# Altium project PCB.PrjPcb
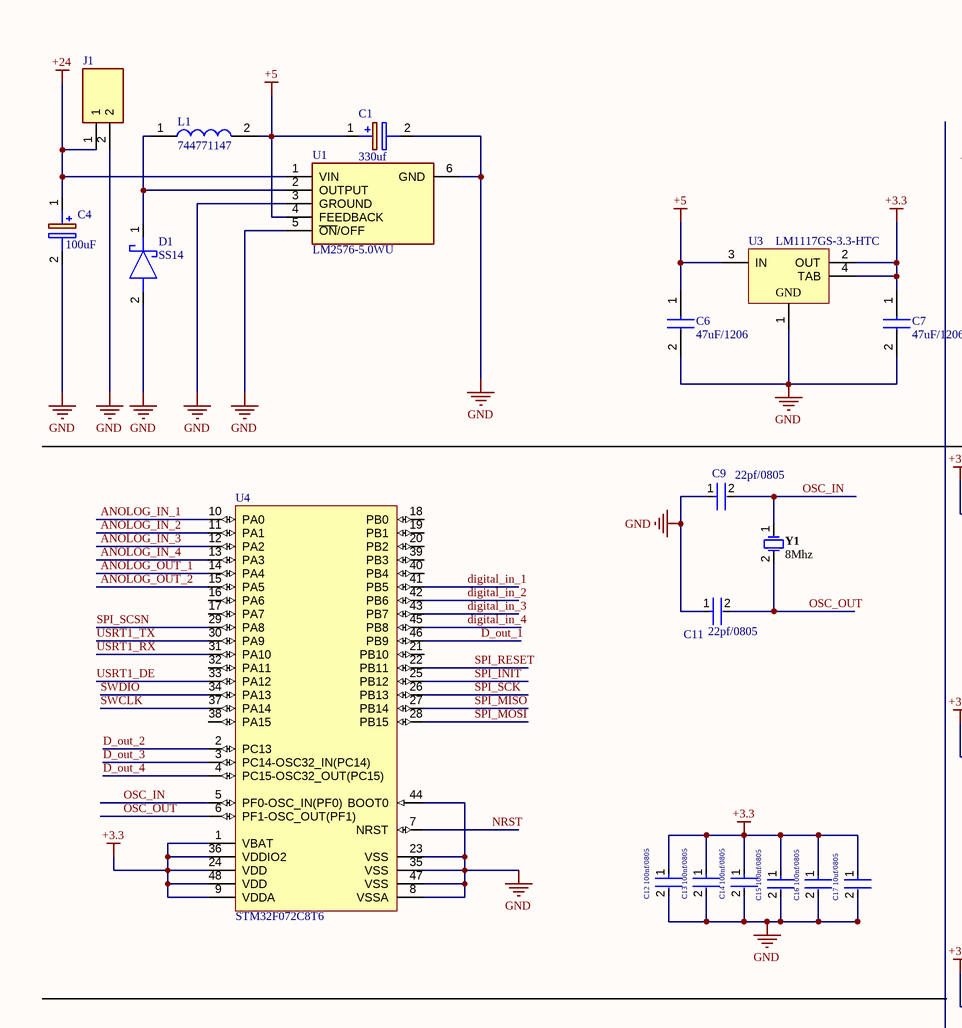
[diagram p0: Sheet1.SchDoc, top left]
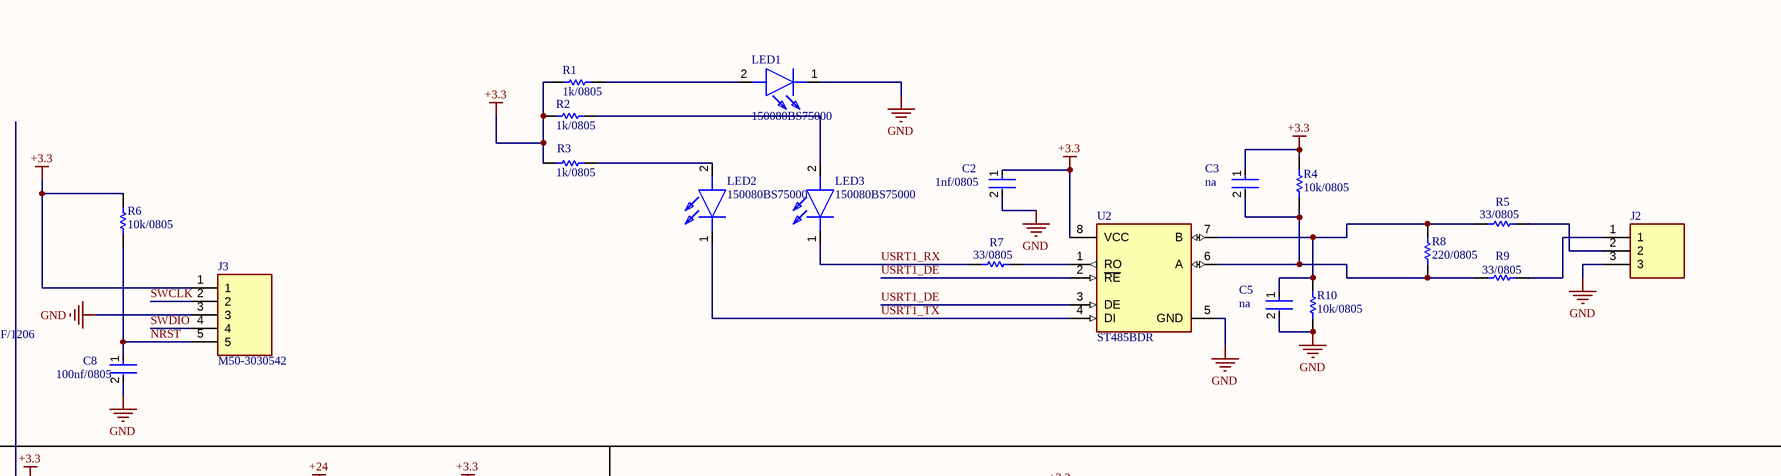
[diagram p1: Sheet1.SchDoc, top right]
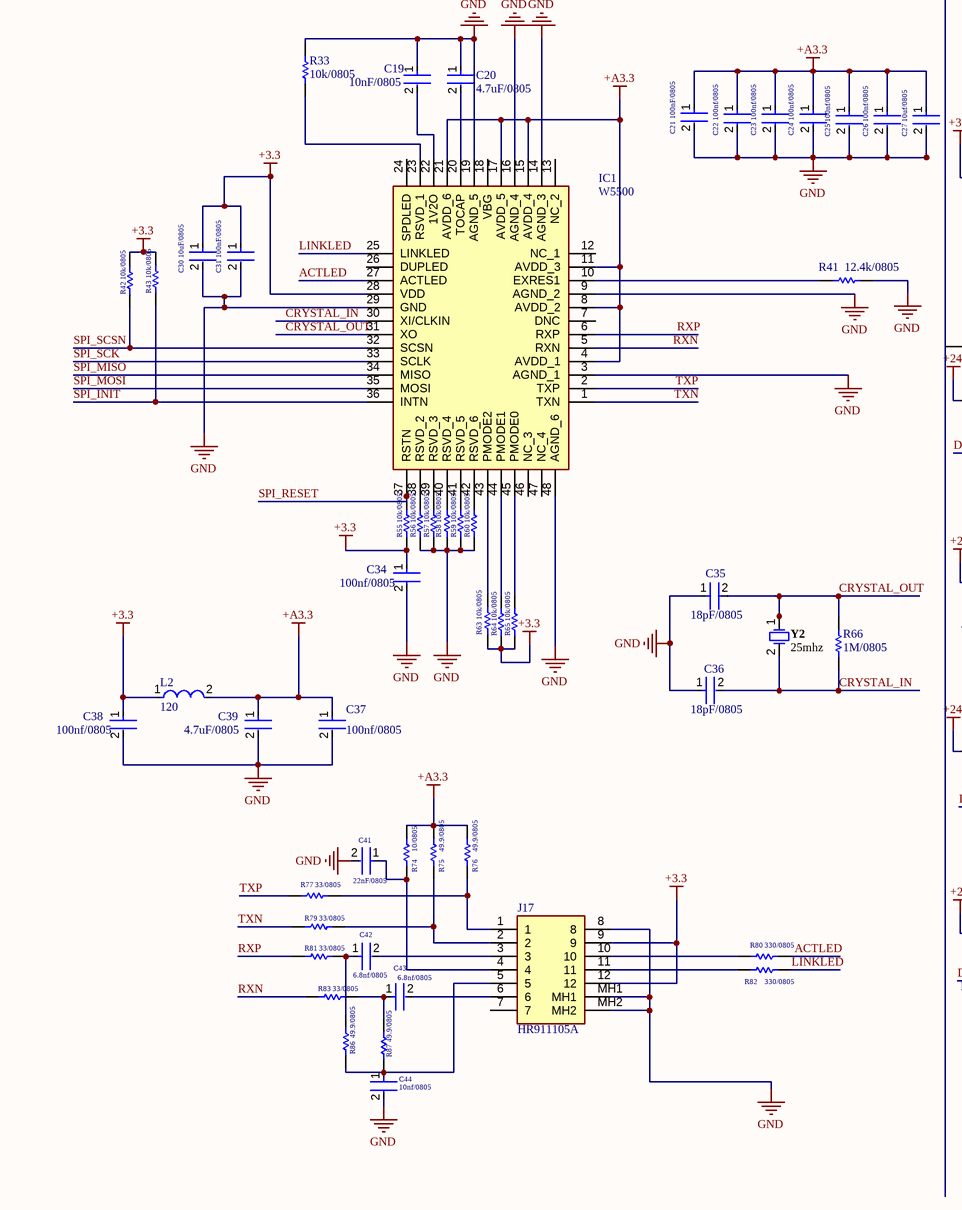
[diagram p2: Sheet1.SchDoc, bottom left]
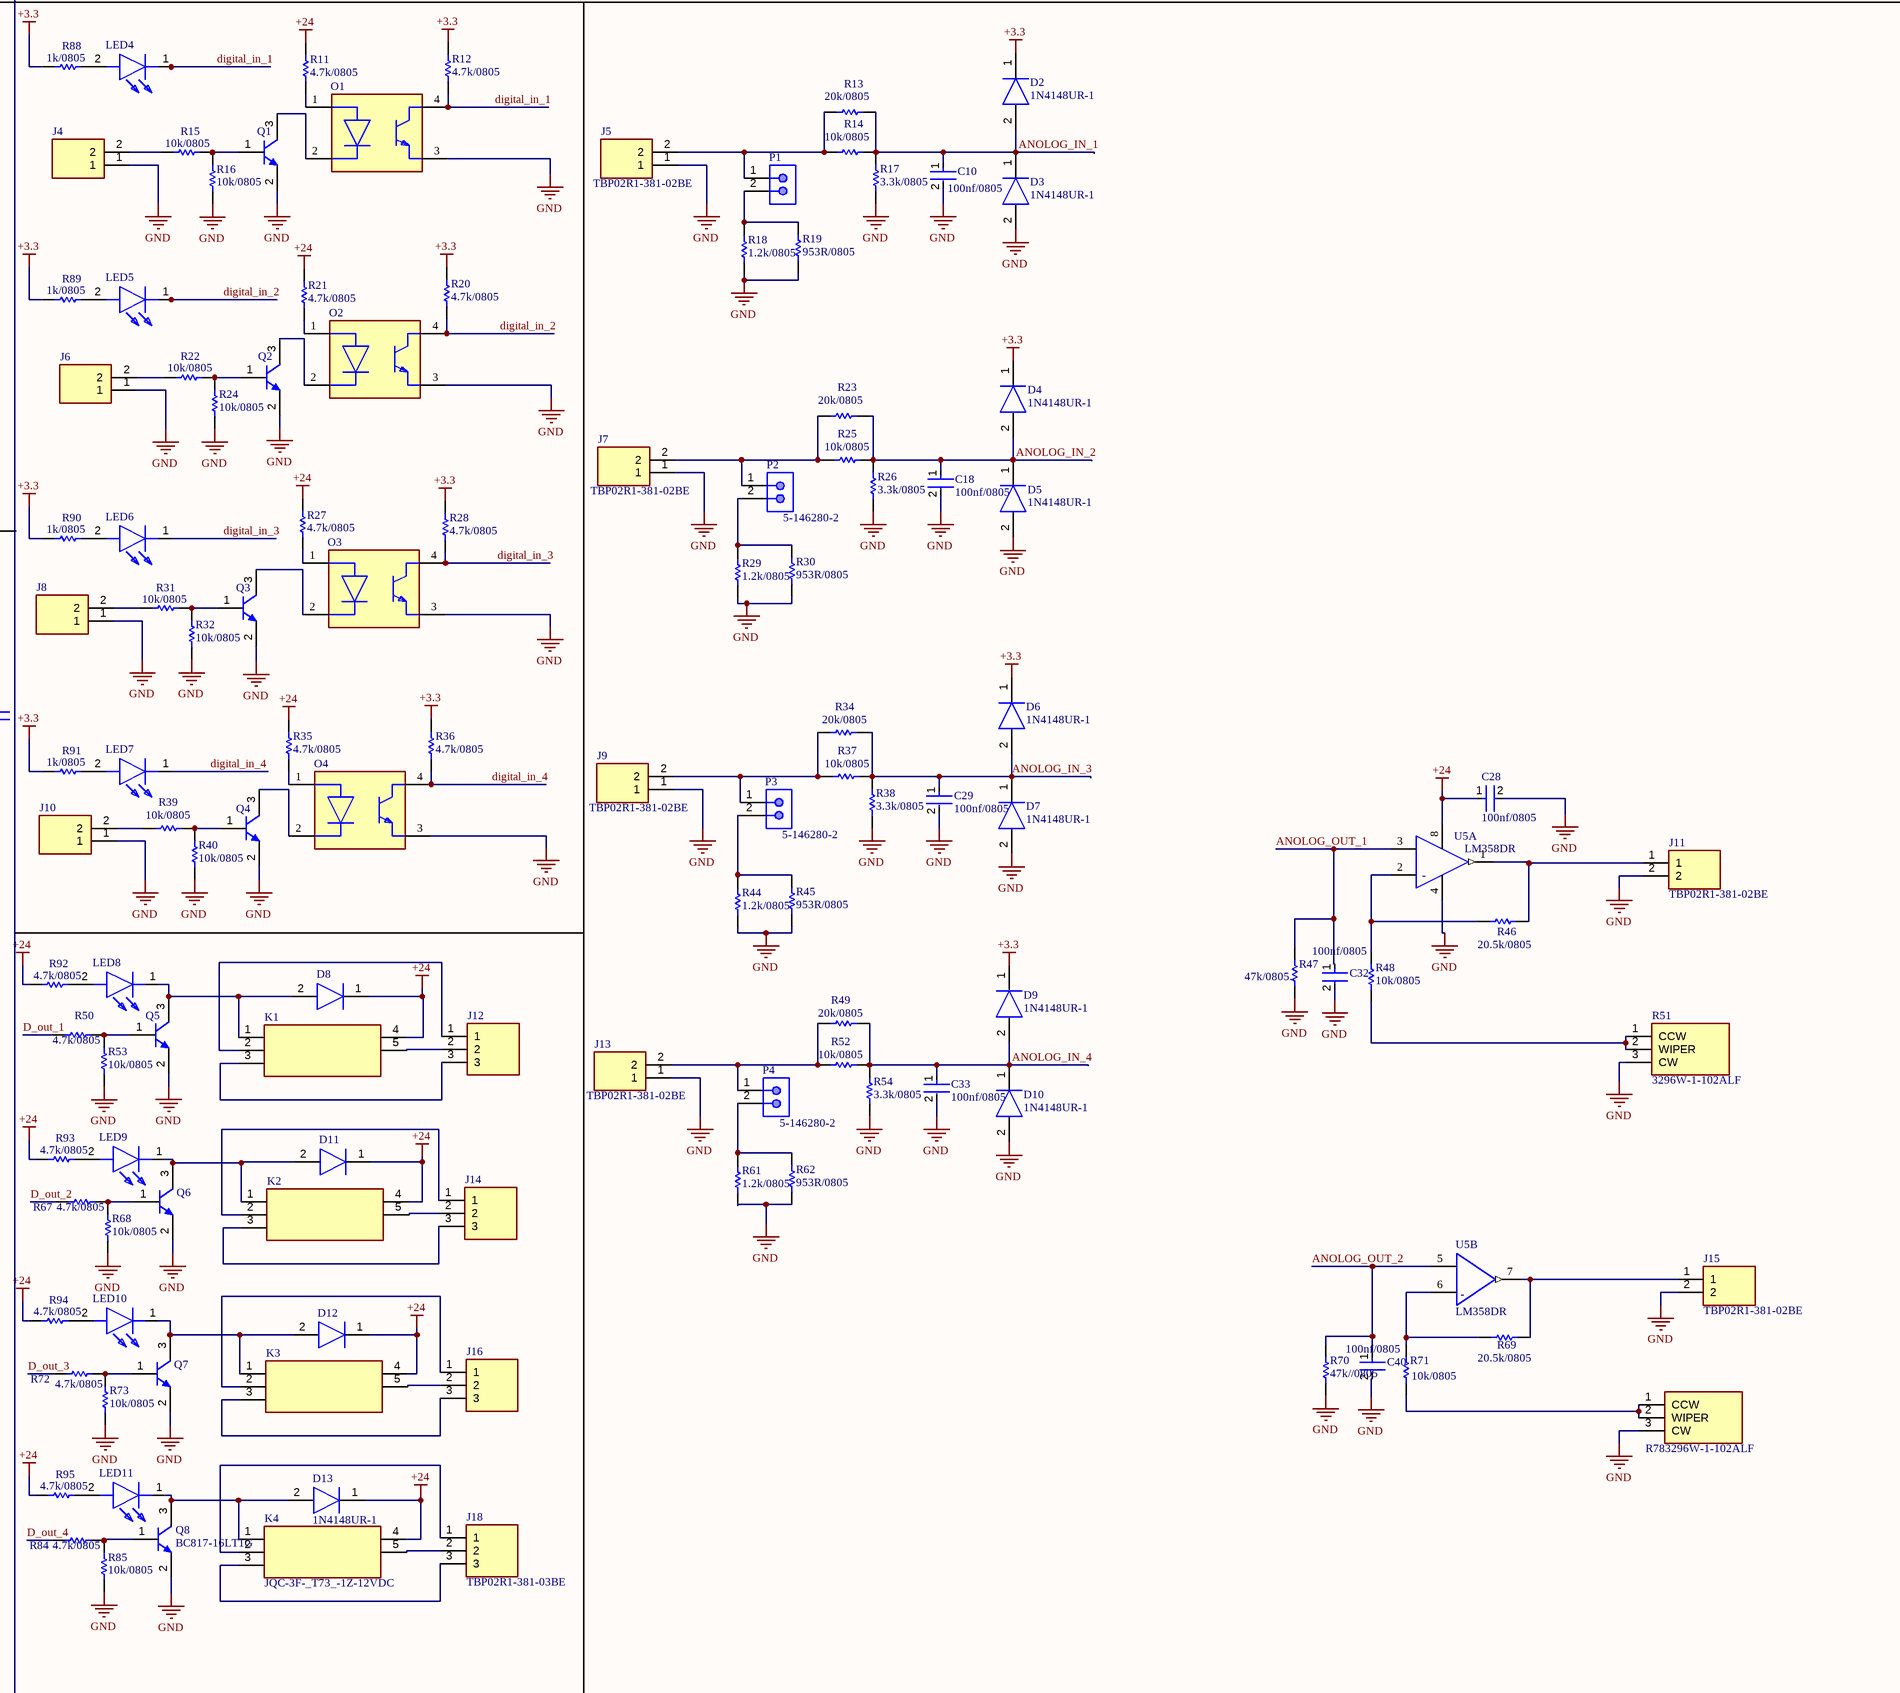
[diagram p3: Sheet1.SchDoc, bottom right]
1 sheet, 211 parts. Net scope: global (net labels, ports and power ports of the same name join across sheets).
Board file: PCB1.PcbDoc

## Sheet Sheet1.SchDoc
size 558 x 431 mm; SheetNumber: 1; SheetTotal: 1

### Parts
C1  330uf  [CAPPRD500W60D1300H2700]
C2  1nf/0805  [FP-C0805C-DG-MFG]
C3  na  [FP-C0805C-DG-MFG]
C4  100uF  [CAPPRD500W60D1300H2700]
C5  na  [FP-C0805C-DG-MFG]
C6  47uF/1206  [CAPC3216X130N]
C7  47uF/1206  [CAPC3216X130N]
C8  100nf/0805  [FP-CL21-IPC_C]
C9  22pf/0805  [FP-CL21-IPC_A]
C10  100nf/0805  [FP-CL21-IPC_C]
C11  22pf/0805  [FP-CL21-IPC_A]
C12  100nf/0805  [FP-CL21-IPC_A]
C13  100nf/0805  [FP-CL21-IPC_A]
C14  100nf/0805  [FP-CL21-IPC_A]
C15  100nf/0805  [FP-CL21-IPC_A]
C16  100nf/0805  [FP-CL21-IPC_A]
C17  10uf/0805  [FP-CL21-IPC_A]
C18  100nf/0805  [FP-CL21-IPC_C]
C19  10nF/0805  [FP-CL21-IPC_A]
C20  4.7uF/0805  [FP-CL21-IPC_A]
C21  100nF/0805  [FP-CL21-IPC_A]
C22  100nf/0805  [FP-CL21-IPC_A]
C23  100nf/0805  [FP-CL21-IPC_A]
C24  100nf/0805  [FP-CL21-IPC_A]
C25  100nf/0805  [FP-CL21-IPC_A]
C26  100nf/0805  [FP-CL21-IPC_A]
C27  10uf/0805  [FP-CL21-IPC_A]
C28  100nf/0805  [FP-CL21-IPC_C]
C29  100nf/0805  [FP-CL21-IPC_C]
C30  10uF/0805  [FP-CL21-IPC_A]
C31  100nF/0805  [FP-CL21-IPC_A]
C32  100nf/0805  [FP-CL21-IPC_C]
C33  100nf/0805  [FP-CL21-IPC_C]
C34  100nf/0805  [FP-CL21-IPC_C]
C35  18pF/0805  [FP-CL21-IPC_A]
C36  18pF/0805  [FP-CL21-IPC_A]
C37  100nf/0805  [FP-CL21-IPC_C]
C38  100nf/0805  [FP-CL21-IPC_C]
C39  4.7uF/0805  [FP-CL21-IPC_C]
C40  100nf/0805  [FP-CL21-IPC_C]
C41  22nF/0805  [FP-CL21-IPC_C]
C42  6.8nf/0805  [FP-CL21-IPC_C]
C43  6.8nf/0805  [FP-CL21-IPC_C]
C44  10nf/0805  [FP-CL21-IPC_C]
D1  SS14  [DIONM5327X242N]
D2  1N4148UR-1  [1N4148UR1]
D3  1N4148UR-1  [1N4148UR1]
D4  1N4148UR-1  [1N4148UR1]
D5  1N4148UR-1  [1N4148UR1]
D6  1N4148UR-1  [1N4148UR1]
D7  1N4148UR-1  [1N4148UR1]
D8  (no value)  [1N4148UR1]
D9  1N4148UR-1  [1N4148UR1]
D10  1N4148UR-1  [1N4148UR1]
D11  (no value)  [1N4148UR1]
D12  (no value)  [1N4148UR1]
D13  1N4148UR-1  [1N4148UR1]
IC1  W5500  [QFP50P900X900X160-48N]
J1  (no value)  [TBP02R138102BE]
J2  (no value)  [TBP02R138103BE]
J3  M50-3030542  [M503030542]
J4  (no value)  [TBP02R138102BE]
J5  TBP02R1-381-02BE  [TBP02R138102BE]
J6  (no value)  [TBP02R138102BE]
J7  TBP02R1-381-02BE  [TBP02R138102BE]
J8  (no value)  [TBP02R138102BE]
J9  TBP02R1-381-02BE  [TBP02R138102BE]
J10  (no value)  [TBP02R138102BE]
J11  TBP02R1-381-02BE  [TBP02R138102BE]
J12  (no value)  [TBP02R138103BE]
J13  TBP02R1-381-02BE  [TBP02R138102BE]
J14  (no value)  [TBP02R138103BE]
J15  TBP02R1-381-02BE  [TBP02R138102BE]
J16  (no value)  [TBP02R138103BE]
J17  HR911105A  [HR911105A]
J18  TBP02R1-381-03BE  [TBP02R138103BE]
K1  (no value)  [JQC3FT731Z12VDC]
K2  (no value)  [JQC3FT731Z12VDC]
K3  (no value)  [JQC3FT731Z12VDC]
K4  JQC-3F-_T73_-1Z-12VDC  [JQC3FT731Z12VDC]
L1  744771147  [INDPM120120X600N]
L2  120  [FP-LQH31CN_03-MFG]
LED1  150080BS75000  [LEDC2012X80N]
LED2  150080BS75000  [LEDC2012X80N]
LED3  150080BS75000  [LEDC2012X80N]
LED4  (no value)  [LEDC2012X80N]
LED5  (no value)  [LEDC2012X80N]
LED6  (no value)  [LEDC2012X80N]
LED7  (no value)  [LEDC2012X80N]
LED8  (no value)  [LEDC2012X80N]
LED9  (no value)  [LEDC2012X80N]
LED10  (no value)  [LEDC2012X80N]
LED11  (no value)  [LEDC2012X80N]
O1  (no value)  [FP-PC817XNNIP0F-MFG]
O2  (no value)  [FP-PC817XNNIP0F-MFG]
O3  (no value)  [FP-PC817XNNIP0F-MFG]
O4  (no value)  [FP-PC817XNNIP0F-MFG]
P1  (no value)  [TECO-5-146280-2_V]
P2  5-146280-2  [TECO-5-146280-2_V]
P3  5-146280-2  [TECO-5-146280-2_V]
P4  5-146280-2  [TECO-5-146280-2_V]
Q1  (no value)  [ONSC-SOT-23-3-318-08_V]
Q2  (no value)  [ONSC-SOT-23-3-318-08_V]
Q3  (no value)  [ONSC-SOT-23-3-318-08_V]
Q4  (no value)  [ONSC-SOT-23-3-318-08_V]
Q5  (no value)  [ONSC-SOT-23-3-318-08_V]
Q6  (no value)  [ONSC-SOT-23-3-318-08_V]
Q7  (no value)  [ONSC-SOT-23-3-318-08_V]
Q8  BC817-16LT1G  [ONSC-SOT-23-3-318-08_V]
R1  1k/0805  [RESC2013X50X30ML20T20]
R2  1k/0805  [RESC2013X50X30ML20T20]
R3  1k/0805  [RESC2013X50X30ML20T20]
R4  10k/0805  [RESC2013X50X30ML20T20]
R5  33/0805  [RESC2013X50X30ML20T20]
R6  10k/0805  [RESC2013X50X30ML20T20]
R7  33/0805  [RESC2013X50X30ML20T20]
R8  220/0805  [RESC2013X50X30ML20T20]
R9  33/0805  [RESC2013X50X30ML20T20]
R10  10k/0805  [RESC2013X50X30ML20T20]
R11  4.7k/0805  [RESC2013X50X30ML20T20]
R12  4.7k/0805  [RESC2013X50X30ML20T20]
R13  20k/0805  [RESC2013X50X30ML20T20]
R14  10k/0805  [RESC2013X50X30ML20T20]
R15  10k/0805  [RESC2013X50X30ML20T20]
R16  10k/0805  [RESC2013X50X30ML20T20]
R17  3.3k/0805  [RESC2013X50X30ML20T20]
R18  1.2k/0805  [RESC2013X50X30ML20T20]
R19  953R/0805  [RESC2013X50X30ML20T20]
R20  4.7k/0805  [RESC2013X50X30ML20T20]
R21  4.7k/0805  [RESC2013X50X30ML20T20]
R22  10k/0805  [RESC2013X50X30ML20T20]
R23  20k/0805  [RESC2013X50X30ML20T20]
R24  10k/0805  [RESC2013X50X30ML20T20]
R25  10k/0805  [RESC2013X50X30ML20T20]
R26  3.3k/0805  [RESC2013X50X30ML20T20]
R27  4.7k/0805  [RESC2013X50X30ML20T20]
R28  4.7k/0805  [RESC2013X50X30ML20T20]
R29  1.2k/0805  [RESC2013X50X30ML20T20]
R30  953R/0805  [RESC2013X50X30ML20T20]
R31  10k/0805  [RESC2013X50X30ML20T20]
R32  10k/0805  [RESC2013X50X30ML20T20]
R33  10k/0805  [RESC2013X50X30ML20T20]
R34  20k/0805  [RESC2013X50X30ML20T20]
R35  4.7k/0805  [RESC2013X50X30ML20T20]
R36  4.7k/0805  [RESC2013X50X30ML20T20]
R37  10k/0805  [RESC2013X50X30ML20T20]
R38  3.3k/0805  [RESC2013X50X30ML20T20]
R39  10k/0805  [RESC2013X50X30ML20T20]
R40  10k/0805  [RESC2013X50X30ML20T20]
R41  12.4k/0805  [RESC2013X50X30ML20T20]
R42  10k/0805  [RESC2013X50X30ML20T20]
R43  10k/0805  [RESC2013X50X30ML20T20]
R44  1.2k/0805  [RESC2013X50X30ML20T20]
R45  953R/0805  [RESC2013X50X30ML20T20]
R46  20.5k/0805  [RESC2013X50X30ML20T20]
R47  47k/0805.  [RESC2013X50X30ML20T20]
R48  10k/0805  [RESC2013X50X30ML20T20]
R49  20k/0805  [RESC2013X50X30ML20T20]
R50  4.7k/0805  [RESC2013X50X30ML20T20]
R51  3296W-1-102ALF  [3296W-1]
R52  10k/0805  [RESC2013X50X30ML20T20]
R53  10k/0805  [RESC2013X50X30ML20T20]
R54  3.3k/0805  [RESC2013X50X30ML20T20]
R55  10k/0805  [RESC2013X50X30ML20T20]
R56  10k/0805  [RESC2013X50X30ML20T20]
R57  10k/0805  [RESC2013X50X30ML20T20]
R58  10k/0805  [RESC2013X50X30ML20T20]
R59  10k/0805  [RESC2013X50X30ML20T20]
R60  10k/0805  [RESC2013X50X30ML20T20]
R61  1.2k/0805  [RESC2013X50X30ML20T20]
R62  953R/0805  [RESC2013X50X30ML20T20]
R63  10k/0805  [RESC2013X50X30ML20T20]
R64  10k/0805  [RESC2013X50X30ML20T20]
R65  10k/0805  [RESC2013X50X30ML20T20]
R66  1M/0805  [RESC2013X50X30ML20T20]
R67  4.7k/0805  [RESC2013X50X30ML20T20]
R68  10k/0805  [RESC2013X50X30ML20T20]
R69  20.5k/0805  [RESC2013X50X30ML20T20]
R70  47k//0805  [RESC2013X50X30ML20T20]
R71  10k/0805  [RESC2013X50X30ML20T20]
R72  4.7k/0805  [RESC2013X50X30ML20T20]
R73  10k/0805  [RESC2013X50X30ML20T20]
R74  10/0805  [RESC2013X50X30ML20T20]
R75  49.9/0805  [RESC2013X50X30ML20T20]
R76  49.9/0805  [RESC2013X50X30ML20T20]
R77  33/0805  [RESC2013X50X30ML20T20]
R78  3296W-1-102ALF  [3296W-1]
R79  33/0805  [RESC2013X50X30ML20T20]
R80  330/0805  [RESC2013X50X30ML20T20]
R81  33/0805  [RESC2013X50X30ML20T20]
R82  330/0805  [RESC2013X50X30ML20T20]
R83  33/0805  [RESC2013X50X30ML20T20]
R84  4.7k/0805  [RESC2013X50X30ML20T20]
R85  10k/0805  [RESC2013X50X30ML20T20]
R86  49.9/0805  [RESC2013X50X30ML20T20]
R87  49.9/0805  [RESC2013X50X30ML20T20]
R88  1k/0805  [RESC2013X50X30ML20T20]
R89  1k/0805  [RESC2013X50X30ML20T20]
R90  1k/0805  [RESC2013X50X30ML20T20]
R91  1k/0805  [RESC2013X50X30ML20T20]
R92  4.7k/0805  [RESC2013X50X30ML20T20]
R93  4.7k/0805  [RESC2013X50X30ML20T20]
R94  4.7k/0805  [RESC2013X50X30ML20T20]
R95  4.7k/0805  [RESC2013X50X30ML20T20]
U1  LM2576-5.0WU  [MICROCHIP_TO-263]
U2  ST485BDR  [FP-SO-8-0016023-IPC_C]
U3  LM1117GS-3.3-HTC  [DCY0004A_L]
U4  STM32F072C8T6  [STM-LQFP48_N]
U5  LM358DR  [FP-D0008A-MFG]  (parts A,B of 2)
Y1  8Mhz  [FOX-FOXSLF080-20]
Y2  25mhz  [FOX-FOXSLF080-20]

### Nets
+3.3: C2.1 C3.1 C7.1 C12.1 C13.1 C14.1 C15.1 C16.1 C17.1 C30.1 C31.1 C34.1 C38.1 D2.1(K) D4.1(K) D6.1(K) D9.1(K) IC1.28(VDD) J3.1 J17.9 J17.12 L2.1 R1.2 R2.2 R3.2 R4.2 R6.2 R12.2 R20.2 R28.2 R36.2 R42.2 R43.2 R55.1 R63.1 R64.1 R65.1 R88.1 R89.1 R90.1 R91.1 U2.8(VCC) U3.2(OUT) U3.4(TAB) U4.1(VBAT) U4.9(VDDA) U4.24(VDD) U4.36(VDDIO2) U4.48(VDD)
+5: C1.1(+) C6.1 L1.2 U1.4(FEEDBACK) U3.3(IN)
+24: C4.1(+) C28.1 D8.1(K) D11.1(K) D12.1(K) D13.1(K) J1.1 K1.4(COIL_2) K2.4(COIL_2) K3.4(COIL_2) K4.4(COIL_2) R11.2 R21.2 R27.2 R35.2 R92.1 R93.1 R94.1 R95.1 U1.1(VIN) U5.8(V+)
+A3.3: C21.1 C22.1 C23.1 C24.1 C25.1 C26.1 C27.1 C37.1 C39.1 IC1.4(AVDD_1) IC1.8(AVDD_2) IC1.11(AVDD_3) IC1.15(AVDD_4) IC1.17(AVDD_5) IC1.21(AVDD_6) L2.2 R74.2 R75.2 R76.2
GND: C1.2(-) C2.2 C4.2(-) C5.2 C6.2 C7.2 C8.2 C9.1 C10.2 C11.1 C12.2 C13.2 C14.2 C15.2 C16.2 C17.2 C18.2 C19.1 C20.1 C21.2 C22.2 C23.2 C24.2 C25.2 C26.2 C27.2 C28.2 C29.2 C30.2 C31.2 C32.2 C33.2 C34.2 C35.1 C36.1 C37.2 C38.2 C39.2 C40.2 C41.2 C44.2 D1.2(A) D3.2(A) D5.2(A) D7.2(A) D10.2(A) IC1.3(AGND_1) IC1.9(AGND_2) IC1.14(AGND_3) IC1.16(AGND_4) IC1.19(AGND_5) IC1.29(GND) IC1.48(AGND_6) J1.2 J2.3 J3.3 J4.1 J5.1 J6.1 J7.1 J8.1 J9.1 J10.1 J11.2 J13.1 J15.2 J17.8 J17.MH1 J17.MH2 LED1.1(K) O1.3(E) O2.3(E) O3.3(E) O4.3(E) Q1.2(E) Q2.2(E) Q3.2(E) Q4.2(E) Q5.2(E) Q6.2(E) Q7.2(E) Q8.2(E) R10.1 R16.1 R17.1 R18.1 R19.1 R24.1 R26.1 R29.1 R30.1 R32.1 R33.2 R38.1 R40.1 R41.2 R44.1 R45.1 R47.1 R51.3(CW) R53.1 R54.1 R56.1 R57.1 R58.1 R59.1 R60.1 R61.1 R62.1 R68.1 R70.1 R73.1 R78.3(CW) R85.1 U1.3(GROUND) U1.5(~{ON}/OFF) U1.6(GND) U2.5(GND) U3.1(GND) U4.8(VSSA) U4.23(VSS) U4.35(VSS) U4.44(BOOT0) U4.47(VSS) U5.4(V-)
ACTLED: IC1.27(ACTLED) R80.2
ANOLOG_IN_1: C10.1 D2.2(A) D3.1(K) R13.2 R14.2 R17.2 U4.10(PA0)
ANOLOG_IN_2: C18.1 D4.2(A) D5.1(K) R23.2 R25.2 R26.2 U4.11(PA1)
ANOLOG_IN_3: C29.1 D6.2(A) D7.1(K) R34.2 R37.2 R38.2 U4.12(PA2)
ANOLOG_IN_4: C33.1 D9.2(A) D10.1(K) R49.2 R52.2 R54.2 U4.13(PA3)
ANOLOG_OUT_1: C32.1 R47.2 U4.14(PA4) U5.3(IN1+)
ANOLOG_OUT_2: C40.1 R70.2 U4.15(PA5) U5.5(IN2+)
CRYSTAL_IN: C36.2 IC1.30(XI/CLKIN) R66.1 Y2.2
CRYSTAL_OUT: C35.2 IC1.31(XO) R66.2 Y2.1
D_out_1: R50.1 U4.46(PB9)
D_out_2: R67.1 U4.2(PC13)
D_out_3: R72.1 U4.3(PC14-OSC32_IN(PC14))
D_out_4: R84.1 U4.4(PC15-OSC32_OUT(PC15))
digital_in_1: LED4.1(K) O1.4(C) R12.1 U4.41(PB5)
digital_in_2: LED5.1(K) O2.4(C) R20.1 U4.42(PB6)
digital_in_3: LED6.1(K) O3.4(C) R28.1 U4.43(PB7)
digital_in_4: LED7.1(K) O4.4(C) R36.1 U4.45(PB8)
LINKLED: IC1.25(LINKLED) R82.2
NRST: C8.1 J3.5 R6.1 U4.7(NRST)
OSC_IN: C9.2 U4.5(PF0-OSC_IN(PF0)) Y1.1
OSC_OUT: C11.2 U4.6(PF1-OSC_OUT(PF1)) Y1.2
RXN: IC1.5(RXN) R83.1
RXP: IC1.6(RXP) R81.1
SPI_INIT: IC1.36(INTN) R43.1 U4.25(PB12)
SPI_MISO: IC1.34(MISO) U4.27(PB14)
SPI_MOSI: IC1.35(MOSI) U4.28(PB15)
SPI_RESET: IC1.37(RSTN) R55.2 U4.22(PB11)
SPI_SCK: IC1.33(SCLK) U4.26(PB13)
SPI_SCSN: IC1.32(SCSN) R42.1 U4.29(PA8)
SWCLK: J3.2 U4.37(PA14)
SWDIO: J3.4 U4.34(PA13)
TXN: IC1.1(TXN) R79.1
TXP: IC1.2(TXP) R77.1
USRT1_DE: U2.2(~{RE}) U2.3(DE) U4.33(PA12)
USRT1_RX: LED3.1(K) R7.1 U4.31(PA10)
USRT1_TX: LED2.1(K) U2.4(DI) U4.30(PA9)
NetC3_2: C3.2 R4.1 R8.1 R9.1 U2.6(A)
NetC5_1: C5.1 R5.1 R8.2 R10.2 U2.7(B)
NetC19_2: C19.2 IC1.22(1V2O)
NetC20_2: C20.2 IC1.20(TOCAP)
NetC41_1: C41.1 J17.4 R74.1
NetC42_1: C42.1 R81.2 R86.2
NetC42_2: C42.2 J17.3
NetC43_1: C43.1 R83.2 R87.2
NetC43_2: C43.2 J17.6
NetC44_1: C44.1 J17.5 R86.1 R87.1
NetD1_1: D1.1(K) L1.1 U1.2(OUTPUT)
NetD8_2: D8.2(A) K1.1(COIL_1) LED8.1(K) Q5.3(C)
NetD11_2: D11.2(A) K2.1(COIL_1) LED9.1(K) Q6.3(C)
NetD12_2: D12.2(A) K3.1(COIL_1) LED10.1(K) Q7.3(C)
NetD13_2: D13.2(A) K4.1(COIL_1) LED11.1(K) Q8.3(C)
NetIC1_10: IC1.10(EXRES1) R41.1
NetIC1_23: IC1.23(RSVD_1) R33.1
NetIC1_38: IC1.38(RSVD_2) R56.2
NetIC1_39: IC1.39(RSVD_3) R57.2
NetIC1_40: IC1.40(RSVD_4) R58.2
NetIC1_41: IC1.41(RSVD_5) R59.2
NetIC1_42: IC1.42(RSVD_6) R60.2
NetIC1_43: IC1.43(PMODE2) R63.2
NetIC1_44: IC1.44(PMODE1) R64.2
NetIC1_45: IC1.45(PMODE0) R65.2
NetJ2_1: J2.1 R9.2
NetJ2_2: J2.2 R5.2
NetJ4_2: J4.2 R15.1
NetJ5_2: J5.2 P1.1 R13.1 R14.1
NetJ6_2: J6.2 R22.1
NetJ7_2: J7.2 P2.1 R23.1 R25.1
NetJ8_2: J8.2 R31.1
NetJ9_2: J9.2 P3.1 R34.1 R37.1
NetJ10_2: J10.2 R39.1
NetJ11_1: J11.1 R46.2 U5.1(1OUT)
NetJ12_1: J12.1 K1.2(NC)
NetJ12_2: J12.2 K1.5(COM)
NetJ12_3: J12.3 K1.3(NO)
NetJ13_2: J13.2 P4.1 R49.1 R52.1
NetJ14_1: J14.1 K2.2(NC)
NetJ14_2: J14.2 K2.5(COM)
NetJ14_3: J14.3 K2.3(NO)
NetJ15_1: J15.1 R69.2 U5.7(2OUT)
NetJ16_1: J16.1 K3.2(NC)
NetJ16_2: J16.2 K3.5(COM)
NetJ16_3: J16.3 K3.3(NO)
NetJ17_1: J17.1 R76.1 R77.2
NetJ17_2: J17.2 R75.1 R79.2
NetJ17_10: J17.10 R80.1
NetJ17_11: J17.11 R82.1
NetJ18_1: J18.1 K4.2(NC)
NetJ18_2: J18.2 K4.5(COM)
NetJ18_3: J18.3 K4.3(NO)
NetLED1_2: LED1.2(A) R1.1
NetLED2_2: LED2.2(A) R3.1
NetLED3_2: LED3.2(A) R2.1
NetLED4_2: LED4.2(A) R88.2
NetLED5_2: LED5.2(A) R89.2
NetLED6_2: LED6.2(A) R90.2
NetLED7_2: LED7.2(A) R91.2
NetLED8_2: LED8.2(A) R92.2
NetLED9_2: LED9.2(A) R93.2
NetLED10_2: LED10.2(A) R94.2
NetLED11_2: LED11.2(A) R95.2
NetO1_1: O1.1(A) R11.1
NetO1_2: O1.2(C) Q1.3(C)
NetO2_1: O2.1(A) R21.1
NetO2_2: O2.2(C) Q2.3(C)
NetO3_1: O3.1(A) R27.1
NetO3_2: O3.2(C) Q3.3(C)
NetO4_1: O4.1(A) R35.1
NetO4_2: O4.2(C) Q4.3(C)
NetP1_2: P1.2 R18.2 R19.2
NetP2_2: P2.2 R29.2 R30.2
NetP3_2: P3.2 R44.2 R45.2
NetP4_2: P4.2 R61.2 R62.2
NetQ1_1: Q1.1(B) R15.2 R16.2
NetQ2_1: Q2.1(B) R22.2 R24.2
NetQ3_1: Q3.1(B) R31.2 R32.2
NetQ4_1: Q4.1(B) R39.2 R40.2
NetQ5_1: Q5.1(B) R50.2 R53.2
NetQ6_1: Q6.1(B) R67.2 R68.2
NetQ7_1: Q7.1(B) R72.2 R73.2
NetQ8_1: Q8.1(B) R84.2 R85.2
NetR7_2: R7.2 U2.1(RO)
NetR46_1: R46.1 R48.2 U5.2(IN1-)
NetR48_1: R48.1 R51.1(CCW) R51.2(WIPER)
NetR69_1: R69.1 R71.2 U5.6(IN2-)
NetR71_1: R71.1 R78.1(CCW) R78.2(WIPER)

Not connected (* = marked no-connect by the designer): IC1 7(DNC) 12(NC_1) 13(NC_2) 18(VBG) 24(SPDLED) 26(DUPLED) 46(NC_3) 47(NC_4); J17 7; U4 16(PA6) 17(PA7) 18(PB0) 19(PB1) 20(PB2) 21(PB10) 32(PA11) 38(PA15) 39(PB3) 40(PB4)

### Notes on the sheet
- DWG. NO.
- REV.
- SHT.
- REVISION
- DESCRIPTION
- DATE
- APPROVED
- THIS DOCUMENT AND THE DATA DISCLOSED HEREIN OR HEREWITH IS THE PROPERTY OF ALTIUM LIMITED AND MAY BE FREELY DISTRIBUTED IN WHOLE. NO RIGHTS ARE RESERVED OR EXPRESS OR IMPLIED WARANTEE GIVEN.
- ENG:
- DSN:
- APPROVALS
- PROJECT
- DOCUMENT REVISION:
- DESIGN ITEM:
- CHK:
- BOM:
- REFERENCE DOCUMENTS
- PROJECT REVISION:
- TITLE
- FAB DWG:
- PCB DWG:
- ASSY DWG:
- SCALE:
- SIZE
- C
- CAGE CODE
- FILE NAME
- DWG NO.
- SHEET
- OF
- REV
- (in symbol CMP-1685-00009-2, part A) -
- (in symbol CMP-1685-00009-2, part B) -

### Library data of the parts
C1 C4 = ESH226M400AL4AA: Capacitor Polarised; Manufacturer_Name: Kemet; Datasheet Link: https://www.mouser.in/datasheet/2/212/KEM_A4005_ESH-1101279.pdf; Height: 27mm; Manufacturer_Part_Number: ESH226M400AL4AA; Mouser Part Number: 80-ESH226M400AL4AA; Mouser Price/Stock: https://www.mouser.co.uk/ProductDetail/KEMET/ESH226M400AL4AA?qs=HkWi%252B9Y4Xq9wCxVrofcRHQ%3D%3D
  C1: Arrow Part Number: ESH226M400AL4AA; Arrow Price/Stock: https://www.arrow.com/en/products/esh226m400al4aa/kemet-corporation?region=nac
C2 C3 C5 = CMP-2007-03243-2: CAP CER 10UF 10V X5R 0805; Manufacturer Part Number: C0805C106K8PACTU; Manufacturer: Kemet; 3DS Part Number: 220-00001; Tolerance: 10%; Temperature Coefficient: 15%; Material: Ceramic; Device Class L2: Capacitors; Device Class L1: Passive Components; ComponentLink2URL: https://content.kemet.com/datasheets/KEM_C1006_X5R_SMD.pdf; Height: 1.4mm; Lead Free: Yes; Digikey Description: CAP CER 10UF 10V X5R 0805; Octopart: https://octopart.com/c0805c106k8pactu-kemet-98697; Capacitance: 10uF; Value: 10uF; Temperature Range Low: -55°C; Temperature: -55°C to +85°C; Automotive: No; Mouser Description: CAP CER 10UF 10V X5R 0805; Ipc Land Pattern Name: CAPC200125X125; Temperature Range High: +85°C; Voltage: 10V; RoHS: TRUE; Device Class L3: Ceramic Capacitors; ComponentLink2Description: Datasheet; Voltage Rating: 10V; Package: C0805C-DG; Temperature Characteristic: X5R; Category: Cap
C6 C7 = CGA5H2C0G1H473J115AA: Capacitor; Manufacturer_Name: TDK; Datasheet Link: http://docs-emea.rs-online.com/webdocs/14e9/0900766b814e9125.pdf; Height: 1.3mm; Manufacturer_Part_Number: CGA5H2C0G1H473J115AA; Mouser Part Number: 810-CGA5H2C0G1H473J; Mouser Price/Stock: https://www.mouser.com/Search/Refine.aspx?Keyword=810-CGA5H2C0G1H473J
C8 C10 C18 C28 C29 C32-C34 C37-C44 = CMP-13271-001776-1: CL21 Series 0805 3.3nF 25V ±5% Tolerance C0G Multilayer Ceramic Chip Capacitor; Thickness: 0.037inch; Tolerance: 5%; Package Quantity: 1; Voltage Rating: 25V; Length: 0.079inch; Case/Package: 0805; Capacitance: 3.3nF; Ratings: AEC-Q200; Max Operating Temperature: 125°C; Case Code (Metric): 2012; Width: 0.049inch; Mount: Surface Mount; Case Code (Imperial): 0805; Min Operating Temperature: -55°C; Packaging: Tape and Reel
C9 C11-C17 C19-C27 C30 C31 C35 C36 = CMP-13271-002308-1: CL21 Series 0805 680nF 25V -20/+80% Tolerance Y5V Multilayer Ceramic Chip Capacitor; Tolerance: 80%; Min Operating Temperature: -30°C; Voltage Rating: 25V; Mount: Surface Mount; Max Operating Temperature: 85°C; Length: 0.079inch; Case Code (Metric): 2012; Packaging: Tape and Reel; Case/Package: 0805; Width: 0.049inch; Thickness: 0.053inch; Capacitance: 680nF; Case Code (Imperial): 0805; Voltage Rating (DC): 25V
D1 = SS14: Schottky Diode; Manufacturer_Name: MDD(Microdiode Electronics); Datasheet Link: https://datasheet.lcsc.com/szlcsc/1903051003_MDD-Jiangsu-Yutai-Elec-SS14_C2480.pdf; Height: 2.42mm; Manufacturer_Part_Number: SS14
D2-D13 = 1N4148UR-1: Diode; Manufacturer_Name: Microsemi Corporation; Datasheet Link: https://www.microsemi.com/document-portal/doc_download/125215-lds-0281-1-datasheet; Height: 1.7mm; Manufacturer_Part_Number: 1N4148UR-1; Mouser Part Number: 494-1N4148UR-1; Mouser Price/Stock: https://www.mouser.co.uk/ProductDetail/Microchip-Microsemi/1N4148UR-1/?qs=%252BRKXB2WKlSdXiNZTe6I9fg%3D%3D; Arrow Part Number: 1N4148UR-1; Arrow Price/Stock: https://www.arrow.com/en/products/1n4148ur-1/microsemi
IC1 = W5500: Integrated Circuit; Manufacturer_Name: WIZnet Inc; Datasheet Link: http://wizwiki.net/wiki/lib/exe/fetch.php?media=products:w5500:w5500_ds_v106e_141230.pdf; Height: 1.6mm; Manufacturer_Part_Number: W5500; Mouser Part Number: 950-W5500; Mouser Price/Stock: https://www.mouser.co.uk/ProductDetail/WIZnet/W5500/?qs=2vh%252B45pPFtzthUpYPd4pqA%3D%3D
J1 J4-J11 J13 J15 = TBP02R1-381-02BE: Connector; Manufacturer_Name: CUI Inc.; Datasheet Link: https://www.cui.com/product/resource/digikeypdf/tbp02r1-381.pdf; Height: 7.2mm; Manufacturer_Part_Number: TBP02R1-381-02BE; Mouser Part Number: 490-TBP02R1-381-02BE; Mouser Price/Stock: https://www.mouser.co.uk/ProductDetail/CUI-Devices/TBP02R1-381-02BE?qs=PzGy0jfpSMuDSg0nR5k9Yg%3D%3D; Arrow Part Number: TBP02R1-381-02BE; Arrow Price/Stock: https://www.arrow.com/en/products/tbp02r1-381-02be/cui-devices
J2 J12 J14 J16 J18 = TBP02R1-381-03BE: Connector; Manufacturer_Name: CUI Inc.; Datasheet Link: https://componentsearchengine.com/Datasheets/1/TBP02R1-381-03BE.pdf; Height: 7.2mm; Manufacturer_Part_Number: TBP02R1-381-03BE; Mouser Part Number: 490-TBP02R1-381-03BE; Mouser Price/Stock: https://www.mouser.co.uk/ProductDetail/CUI-Devices/TBP02R1-381-03BE?qs=PzGy0jfpSMsals0OxoQVLg%3D%3D; Arrow Part Number: TBP02R1-381-03BE; Arrow Price/Stock: https://www.arrow.com/en/products/tbp02r1-381-03be/cui-inc
J3 = M50-3030542: Connector; Manufacturer_Name: Harwin; Datasheet Link: https://www.mouser.com/datasheet/2/181/M50-303-1100763.pdf; Height: 4.55mm; Manufacturer_Part_Number: M50-3030542; Mouser Part Number: 855-M50-3030542; Mouser Price/Stock: https://www.mouser.co.uk/ProductDetail/Harwin/M50-3030542?qs=%252BdQmOuGyFcEea1rf%2Fn%2FOkw%3D%3D
J17 = HR911105A: Connector; Manufacturer_Name: Hanrun Electronics; Datasheet Link: https://datasheet.lcsc.com/szlcsc/Zhongshan-HanRun-Elec-HR911105A_C12074.pdf; Height: 13.75mm; Manufacturer_Part_Number: HR911105A
K1-K4 = JQC-3F-_T73_-1Z-12VDC: Relay or Contactor; Manufacturer_Name: QIANJI; Manufacturer_Part_Number: JQC-3F-(T73)-1Z-12VDC; Datasheet Link: https://img.ozdisan.com/ETicaret_Dosya/341245_8627675.pdf; Height: 15.5mm
L1 = 744771147: Inductor; Manufacturer_Name: Wurth Elektronik; Datasheet Link: https://katalog.we-online.de/pbs/datasheet/744771147.pdf; Height: 6mm; Manufacturer_Part_Number: 744771147; Mouser Part Number: 710-744771147; Mouser Price/Stock: https://www.mouser.co.uk/ProductDetail/Wurth-Elektronik/744771147?qs=E%2F%2FhvbtCqpOhwyt0vks33w%3D%3D
L2 = CMP-06042-002030-1: Wire Wound Ferrite Inductor for General Circuits 56μH ±10% 11.57Ω 50mA 1206; Self Resonant Frequency: 9MHz; Shielding: Unshielded; Test Frequency: 1MHz; DC Resistance (DCR): 8.9R; Inductance: 56uH; Q Factor: 40; Case/Package: 1206; Inductance Tolerance: 10%; Min Operating Temperature: -25°C; DC Current: 50mA; Case Code (Imperial): 1206; Weight: 0.001023oz; Tolerance: 10%; Length: 0.126inch; Mount: Surface Mount; Package Quantity: 2000; Depth: 1.8mm; Max DC Current: 50mA; Packaging: Tape and Reel; Height - Seated (Max): 0.079inch; Core Material: Ferrite; REACH SVHC: No SVHC; Current Rating: 50mA; Case Code (Metric): 3216; Radiation Hardening: No; Resistor Type: Wirewound; Number of Pins: 2; Termination: SMD/SMT; Military Standard: Not; Width: 1.6mm; Height: 0.071inch; Max Operating Temperature: 85°C
LED1-LED11 = 150080BS75000: LED; Manufacturer_Name: Wurth Elektronik; Datasheet Link: https://katalog.we-online.com/led/datasheet/150080BS75000.pdf; Height: 0.8mm; Manufacturer_Part_Number: 150080BS75000; Mouser Part Number: 710-150080BS75000; Mouser Price/Stock: https://www.mouser.co.uk/ProductDetail/Wurth-Elektronik/150080BS75000?qs=2kOmHSv6VfT2tBo3UPVqAQ%3D%3D
O1-O4 = CMP-65434-000005-1: OPTOISOLATOR 5KV TRANS 4SMD; Reverse Breakdown Voltage: 6V; Output Current per Channel: 30mA; Power Dissipation: 200mW; Collector-emitter Voltage-Max: 200mV; Max Output Voltage: 80V; Input Current: 50mA; Forward Voltage: 1.4V; Fall Time: 18000ns; Number of Elements: 1; Input Type: DC; Packaging: Tape and Reel; RoHS Compliant: Yes; Contact Plating: Copper; Min Operating Temperature: -30°C; Collector Emitter Saturation Voltage: 200mV; Max Input Current: 50mA; Radiation Hardening: No; Max Collector Current: 50mA; Case/Package: SMD/SMT; Mount: Surface Mount; Output Voltage: 80V; Forward Current: 50mA; Max Power Dissipation: 200mW; Collector Emitter Voltage (VCEO): 80V; Number of Channels: 1; Rise Time: 18000ns; Isolation Voltage: 5kV; Number of Pins: 4; Lead Free: Lead Free; Package Quantity: 2000; Isolation Voltage-Max: 5kV; Max Operating Temperature: 100°C
P1-P4 = CMP-2000-07492-1: Male Header, Pitch 2.54 mm, 1 x 2 Position, Height 8.21 mm, Tail Length 3.05 mm, -65 to 105 degC, RoHS, Bulk; Manufacturer: TE Connectivity; Mating Connector Lock: No(Without); Number of Positions: 2; Pitch: 2.54mm; PCB Mounting Orientation: Vertical; Keyed: No; Case\/Package: 100; Mating Post Length: 0.23inch; High Temperature Housing: Yes; Max Current Rating: 5A; PCB Thickness: 0.063inch; PCB Mount Retention: Without; Approvals: CSA; Current Rating: 3A; Radiation Hardening: No; Length: 4.67mm; Contact Mating Length: 0.23inch; Connector Type: Header; Number of Rows: 1; Termination Post Length: 0.12inch; Board Standoff: No(Without); Max Operating Temperature: 105degC; Contact Shape: Square; Selectively Loaded: No(Without); Gasket: No(Without); Number of Contacts: 2; Contact Gender: Male; Mating Alignment: No(Without); Manufacturer URL: http://www.te.com/; Datasheet URL: http://www.te.com/commerce/DocumentDelivery/DDEController?Action=showdoc&DocId=Customer+Drawing%7F146280%7FH1%7Fpdf%7FEnglish%7FENG_CD_146280_H1.pdf%7F5-146280-2; Mount: ThroughHole; Orientation: Straight; Packaging: Carton; Package Reference: 5-146280-2; Package Quantity: 500; Stabilizers: No(Without); Row Spacing: 2.54mm; Contact Material: CopperAlloy; Panel Mount Retention: No(Without); Datasheet Version: Rev. H1, 08/2016; Housing Colour: Black; Colour: Black; Package Description: Male Header, Pitch 2.54 mm, 1 x 2 Position, Height 8.21 mm, Tail Length 3.05 mm; Contact Plating: Matte; Housing Material: Polymer; Contact Protection: No(Without); Min Operating Temperature: -65degC; Mounting Technology: ThroughHole; Flammability Rating: UL94V-0; RoHSCompliant: true; Termination: ThroughHole; Depth: 2.34mm; High Speed Serial Data Connector: No
Q1-Q7 = CMP-1048-00736-1: General Purpose Transistor, NPN Silicon, 3-Pin SOT-23, Pb-Free, Tape and Reel; PartNumber: BC817-16LT1G; Manufacturer: On Semiconductor; IC Continuous (A): 0.5; fT Min (MHz): 100; Mounting Technology: Surface Mount; PackageVersion: Rev. AP, 11/2009; ComponentLink3Description: Package Specification; PackageReference: SOT-23-3-318-08; Packing: Tape and Reel; ComponentLink1URL: http://www.onsemi.com/; Polarity: NPN; RoHS: TRUE; ComponentLink2URL: http://www.onsemi.com/pub_link/Collateral/BC817-16LT1-D.PDF; ComponentLink3URL: http://www.onsemi.cn/pub_link/Collateral/318-08.PDF; ComponentLink2Description: Datasheet; PackageDescription: 3-Pin Small Outline Transistor, Body 2.92 x 1.3 mm, Pitch 0.95 mm; ComponentLink1Description: Manufacturer URL; DatasheetVersion: Rev. 12
Q8 = CMP-1048-00736-1: General Purpose Transistor, NPN Silicon, 3-Pin SOT-23, Pb-Free, Tape and Reel; Manufacturer: On Semiconductor; IC Continuous (A): 0.5; fT Min (MHz): 100; PartNumber: BC817-16LT1G; Mounting Technology: Surface Mount; PackageVersion: Rev. AP, 11/2009; ComponentLink3Description: Package Specification; PackageReference: SOT-23-3-318-08; Packing: Tape and Reel; ComponentLink1URL: http://www.onsemi.com/; Polarity: NPN; RoHS: TRUE; ComponentLink2URL: http://www.onsemi.com/pub_link/Collateral/BC817-16LT1-D.PDF; ComponentLink3URL: http://www.onsemi.cn/pub_link/Collateral/318-08.PDF; ComponentLink2Description: Datasheet; PackageDescription: 3-Pin Small Outline Transistor, Body 2.92 x 1.3 mm, Pitch 0.95 mm; ComponentLink1Description: Manufacturer URL; DatasheetVersion: Rev. 12
R1-R50 R52-R77 R79-R95 = CMP-2001-03735-1: Part Number: CRCW0805270RFKEA; Manufacturer: Vishay Dale
R51 R78 = 3296W-1-102ALF: Resistor; Manufacturer_Name: Bourns; Datasheet Link: http://uk.rs-online.com/web/p/products/5219619; Manufacturer_Part_Number: 3296W-1-102ALF; Mouser Part Number: 652-3296W-1-102ALF; Mouser Price/Stock: https://www.mouser.co.uk/ProductDetail/Bourns/3296W-1-102ALF?qs=C%2Ff1xGyhTw3d4nKw44u62g%3D%3D; Arrow Part Number: 3296W-1-102ALF; Arrow Price/Stock: https://www.arrow.com/en/products/3296w-1-102alf/bourns
U1 = LM2576-5.0WU: Undefined or Miscellaneous; Manufacturer_Name: Microchip; Datasheet Link: http://ww1.microchip.com/downloads/en/DeviceDoc/lm2576.pdf; Manufacturer_Part_Number: LM2576-5.0WU; Mouser Part Number: 998-LM2576-5.0WU; Mouser Price/Stock: https://www.mouser.co.uk/ProductDetail/Microchip-Technology-Micrel/LM2576-50WU/?qs=kh6iOki%2FeLHlI9xhWDTjJw%3D%3D; Arrow Part Number: LM2576-5.0WU; Arrow Price/Stock: https://www.arrow.com/en/products/lm2576-5.0wu/microchip-technology
U2 = CMP-12111-000005-1: IC TXRX 5V RS485/422 LP 8-SOIC; Manufacturer: STMicroelectronics; Nominal Supply Current: 300-400uA; Max Supply Voltage: 5.25V; Number Of Receivers: 1; Simplex Duplex: Half-duplex; Data Rate: 2.5Mbits/s; Interface: RS-485,RS-422; Min Supply Voltage: 4.75V; Standoff Height: 0.1mm; Temperature: -40°C to +85°C; Lead Free: Yes; Manufacturer Part Number: ST485BDR; Device Class L3: RS-232 / RS-422 / RS-485 Interface ICs; Octopart: https://octopart.com/st485bdr-stmicroelectronics-503862; Device Class L2: Interface ICs; Category: IC; ComponentLink2URL: https://www.st.com/resource/en/datasheet/st485b.pdf; Device Class L1: Integrated Circuits (ICs); Temperature Range High: +85°C; Number Of Transmitters: 1; RoHS: TRUE; ComponentLink2Description: Datasheet; Height: 1.75mm; Package: SO-8-0016023; Digikey Description: IC TXRX 5V RS485/422 LP 8-SOIC; Ipc Land Pattern Name: SOIC127P600X155-8; Automotive: No; Mouser Description: RS-422/RS-485 Interface IC Hi-Spd Lo Pwr Trans; Temperature Range Low: -40°C
U3 = CMP-0062-01638-4: 800mA Low-Dropout Linear Regulator, 4-pin SOT-223, Pb-Free; PartNumber: LM1117MP-3.3/NOPB; Manufacturer: Texas Instruments; CompType: LDO IC; PackageTopMarking: XYTT*N05A; High-Reliability: Y; PowerWise: N; ComponentLink1URL: http://www.ti.com/general/docs/lit/getliterature.tsp?genericPartNumber=LM1117-N&fileType=pdf; PinCount: 4; PackageDescription: Molded SOT-223, 6.50 x 3.56 x 1.6mm Body, 4 Lead, 2.3mm Pitch; Code_IPC: SOT223-4; Code_JEDEC: TO-261-AA; RoHS: Y; PackageReference: DCY0004A; ComponentLink1Description: Datasheet URL
U4 = CMP-0304-00166-4: ARM Cortex-M0 32-bit MCU, 64 KB Flash, 16 KB Internal RAM, 37 I/Os, 48-Pin LQFP, -40 to 85 degC, Tray; Manufacturer: STMicroelectronics; Operating Frequency(F) (Processor speed) (MHz): 48; FLASH Size (Prog) (kB): 64; I/Os (High Current): 37; D/A Converter: 1; Internal RAM Size (kB): 16; Supply Voltage(Vcc) min (V): 2; Package Reference: LQFP48; DatasheetVersion: Rev. 5; Core: ARM Cortex-M0; ComponentLink1Description: Manufacturer URL; ComponentLink1URL: http://www.st.com/; Packing: Tray; Mounting Technology: Surface Mount; Package Description: 48-Pin Low Profile Quad Flat Package, Body 7 x 7 mm, Pitch 0.5 mm; ComponentLink2URL: http://www.st.com/st-web-ui/static/active/en/resource/technical/document/datasheet/DM00090510.pdf; ComponentLink2Description: Datasheet; PartNumber: STM32F072C8T6
U5 = CMP-1685-00009-2: IC OPAMP GP 2 CIRCUIT 8SOIC; Output Current: 30mA; Min Dual Supply Voltage: 1.5V; Input Offset Voltage (Vos): 7mV; Power Supply Rejection Ratio (PSRR): 65dB; Unity Gain Bandwidth Product: 700kHz; Number of Channels: 2; Min Supply Voltage: 3V; Max Dual Supply Voltage: 16V; Dual Supply Voltage: 9V; Max Supply Voltage: 32V; Nominal Supply Current: 1.2mA; Slew Rate: 0.3V/µs; Input Bias Current: 250nA; Voltage Gain: 100dB; Operating Supply Current: 1mA; REACH SVHC: No SVHC; Package Quantity: 2500; Width: 3.91mm; Max Operating Temperature: 70°C; Min Operating Temperature: 0°C; Mount: Surface Mount; Length: 4.9mm; Radiation Hardening: No; Case/Package: SOIC; Lead Free: Lead Free; Number of Elements: 2; Packaging: Tape and Reel; Output Current per Channel: 30mA; Number of Circuits: 2; Bandwidth: 700kHz; Operating Supply Voltage: 16V; Gain Bandwidth Product: 700kHz; Number of Pins: 8; Number of Amplifiers: 2; Height: 1.58mm; Common Mode Rejection Ratio: 65dB; Contact Plating: Gold
Y1 Y2 = CMP-1749-00002-1: Resistance Weld Thru-Hole Crystal, 8 MHz, -20 to 70 degC, 2-Pin THD, RoHS, Bulk; Dropout Voltage: 2 V; Outputs: 1; Nominal Output Voltage: 5 V; Min Input Voltage: 7 V; Case\Package: TO-263-3; Max Input Voltage: 35 V; Max Ouput Current: 1 A; Length: 10.24 mm; Max Operating Temperature: 125 degC; Mount: Surface Mount; PackageDescription: 2-Pin Through Hole Device, Body 11.35 x 4.65 mm; Package Quantity: 50; Pins: 3; ComponentLink2URL: http://download.siliconexpert.com/pdfs/2015/4/5/6/5/7/200/fox_/manual/35607121449963728hc49slf.pdf; PackageReference: FOXSLF080-20; Min Operating Temperature: 0 degC; Height: 30.02 mm; Packaging: Rail/Tube; Radiation Hardening: No; Width: 9.35 mm; ComponentLink1URL: http://www.foxonline.com/; DatasheetVersion: Mar-15; ComponentLink1Description: Manufacturer URL; Output Voltage: 5 V; RoHSCompliant: true; REACH SVHC: No SVHC; Output Current: 1 A; ComponentLink2Description: Datasheet